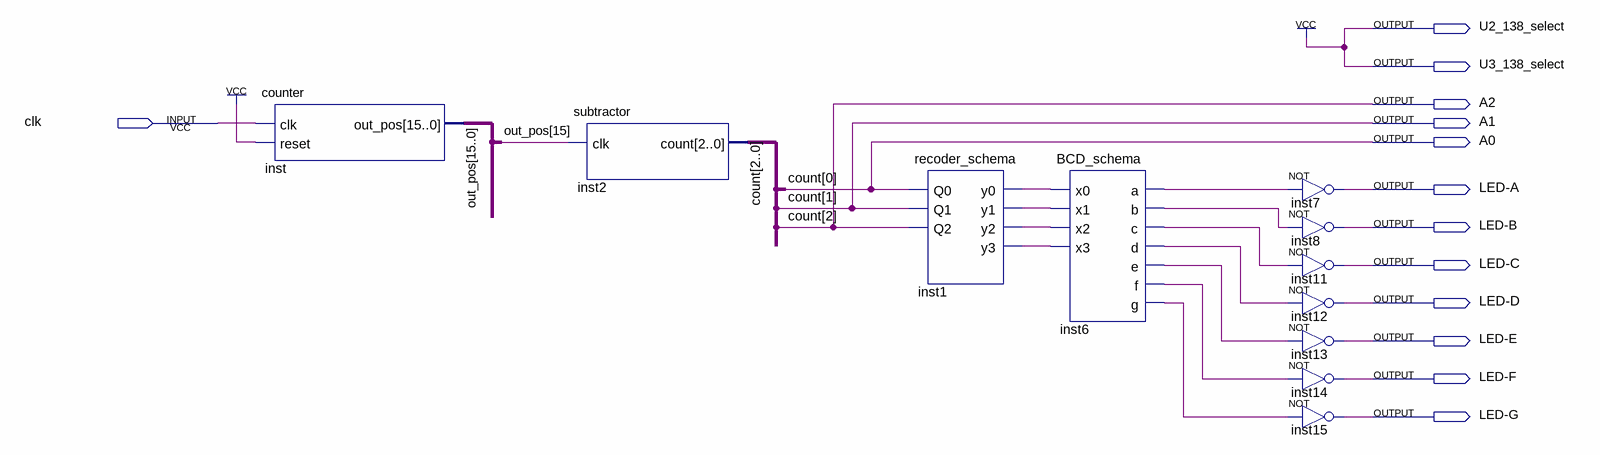
[diagram p0: schematic sheet]
// Quartus schematic main.bdf as structural Verilog: 11 symbols, 13 pins
module main (
  input  clk,
  output U2_138_select,
  output U3_138_select,
  output A2,
  output A1,
  output A0,
  output \LED-A ,
  output \LED-B ,
  output \LED-C ,
  output \LED-D ,
  output \LED-E ,
  output \LED-F ,
  output \LED-G 
);

  wire inst1_y0, inst1_y1, inst1_y2, inst1_y3, inst6_a, inst6_b, inst6_c, inst6_d, inst6_e, inst6_f, inst6_g;
  wire [15:0] out_pos;

  counter inst (.clk(clk), .reset(1'b1), .out_pos(out_pos));
  subtractor inst2 (.clk(out_pos[15]), .count({A2, A1, A0}));
  recoder_schema inst1 (.Q0(A0), .Q1(A1), .Q2(A2), .y0(inst1_y0), .y1(inst1_y1), .y2(inst1_y2), .y3(inst1_y3));
  BCD_schema inst6 (
    .x0(inst1_y0), .x1(inst1_y1), .x2(inst1_y2), .x3(inst1_y3), .a(inst6_a), .b(inst6_b), .c(inst6_c),
    .d(inst6_d), .e(inst6_e), .f(inst6_f), .g(inst6_g));
  not inst7 (\LED-A , inst6_a);
  not inst8 (\LED-B , inst6_b);
  not inst11 (\LED-C , inst6_c);
  not inst12 (\LED-D , inst6_d);
  not inst13 (\LED-E , inst6_e);
  not inst14 (\LED-F , inst6_f);
  not inst15 (\LED-G , inst6_g);

  assign U2_138_select = 1'b1;
  assign U3_138_select = 1'b1;

  // Other names for the same wires on the sheet: count[2:0] = {A2, A1, A0}
endmodule
